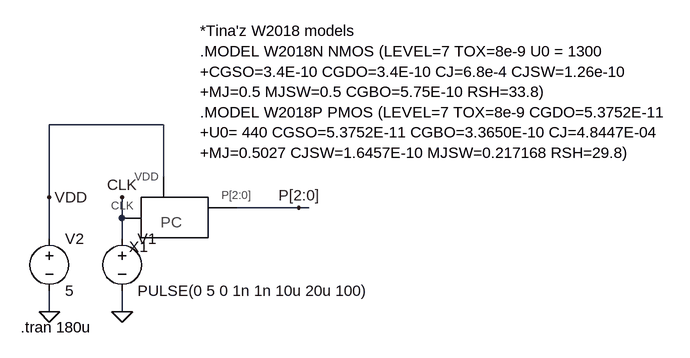
[diagram p0: schematic PCTEST.asc]
PCTEST.asc, the LTspice schematic file:
Version 4
SHEET 1 880 680
WIRE 64 96 -112 96
WIRE 64 176 64 96
WIRE -112 208 -112 96
WIRE 272 224 176 224
WIRE 288 224 272 224
WIRE 0 240 0 208
WIRE -112 272 -112 208
WIRE 0 272 0 240
WIRE -112 384 -112 352
WIRE 0 384 0 352
FLAG 0 208 CLK
FLAG 0 384 0
FLAG -112 208 VDD
FLAG -112 384 0
FLAG 272 224 P[2:0]
SYMBOL voltage 0 256 R0
WINDOW 123 0 0 Left 2
WINDOW 39 0 0 Left 2
SYMATTR InstName V1
SYMATTR Value PULSE(0 5 0 1n 1n 10u 20u 100)
SYMBOL voltage -112 256 R0
WINDOW 123 0 0 Left 2
WINDOW 39 0 0 Left 2
SYMATTR InstName V2
SYMATTR Value 5
SYMBOL PC 64 224 R0
SYMATTR InstName X1
TEXT -156 408 Left 2 !.tran 180u
TEXT 120 -48 Left 2 !*Tina'z W2018 models\n.MODEL W2018N NMOS (LEVEL=7 TOX=8e-9 U0 = 1300\n+CGSO=3.4E-10 CGDO=3.4E-10 CJ=6.8e-4 CJSW=1.26e-10\n+MJ=0.5 MJSW=0.5 CGBO=5.75E-10 RSH=33.8)\n.MODEL W2018P PMOS (LEVEL=7 TOX=8e-9 CGDO=5.3752E-11\n+U0= 440 CGSO=5.3752E-11 CGBO=3.3650E-10 CJ=4.8447E-04\n+MJ=0.5027 CJSW=1.6457E-10 MJSW=0.217168 RSH=29.8)

The netlist it stands for:
* PCTEST.asc
V1 CLK 0 PULSE(0 5 0 1n 1n 10u 20u 100)
V2 VDD 0 5
XX1 CLK VDD P[2] P[1] P[0] PC  ; pins CLK VDD P[2:0]
.tran 180u
*Tina'z W2018 models
.MODEL W2018N NMOS (LEVEL=7 TOX=8e-9 U0 = 1300
+CGSO=3.4E-10 CGDO=3.4E-10 CJ=6.8e-4 CJSW=1.26e-10
+MJ=0.5 MJSW=0.5 CGBO=5.75E-10 RSH=33.8)
.MODEL W2018P PMOS (LEVEL=7 TOX=8e-9 CGDO=5.3752E-11
+U0= 440 CGSO=5.3752E-11 CGBO=3.3650E-10 CJ=4.8447E-04
+MJ=0.5027 CJSW=1.6457E-10 MJSW=0.217168 RSH=29.8)
.backanno
.end